# Altium schematic sheet DDC.SchDoc: Apalis Evaluation Board 1.1
size A3; Organization: Toradex AG; Address1: Altsagenstrasse 5; Address2: Horw; Address3: 6048; Address4: Switzerland; DocumentNumber: 19; Revision: V1.1; SheetNumber: 19; SheetTotal: 32; PageSetup: Record=PageOptions|CenterHorizontal=True|CenterVertical=True|PrintScale=0.71|XCorrection=1.00|YCorrection=1.00|PrintKind=0|BorderSize=5000000|LeftOffset=0|BottomOffset=0|Orientation=2|PaperLength=1000|PaperWidth=1000|Scale=100|PaperSource=7|PrintQuality=-4|MediaType=1|DitherType=10|PaperKind=A4|PrintScaleMode=1
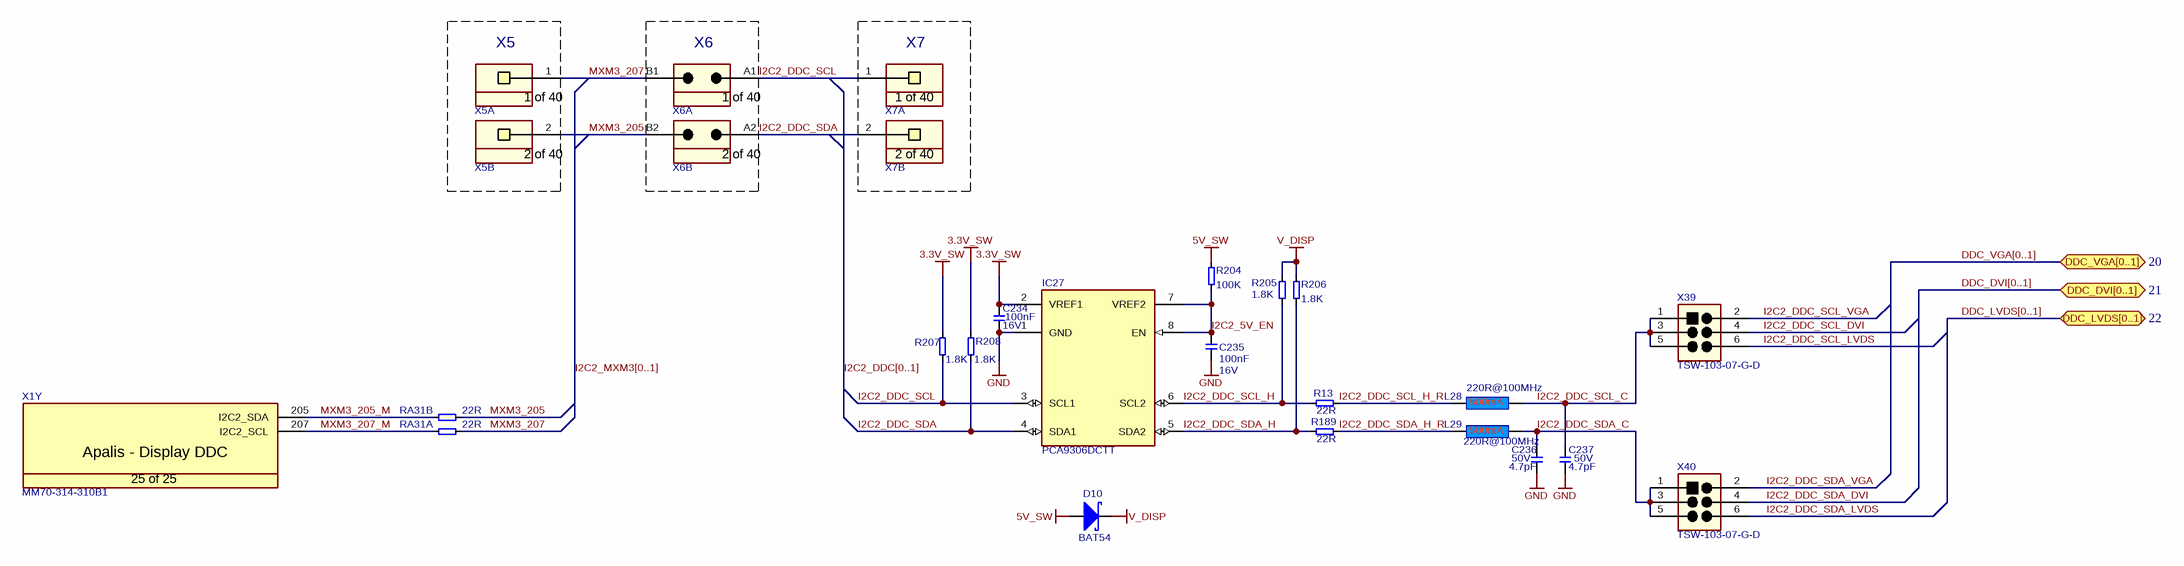
[diagram p0: DDC.SchDoc]

## Parts
C234  Rating: 16V  [T_CAPC0603X33N]  (hidden comment: 100nF)
C235  Rating: 16V  [T_CAPC0603X33N]  (hidden comment: 100nF)
C236  Rating: 50V  [T_CAPC0603X33N]  (hidden comment: 4.7pF)
C237  Rating: 50V  [T_CAPC0603X33N]  (hidden comment: 4.7pF)
D10  BAT54  [SOT95P230X110-3N]
IC27  PCA9306DCTT  [T_TI_PCA9306DCTT]
L28  220R@100MHz  [INDC1608X95N]
L29  220R@100MHz  [INDC1608X95N]
R13  22R  [T_RESC0603X30N]
R189  22R  [T_RESC0603X30N]
R204  100K  [T_RESC0603X30N]
R205  1.8K  [T_RESC0603X30N]
R206  1.8K  [T_RESC0603X30N]
R207  1.8K  [T_RESC0603X30N]
R208  1.8K  [T_RESC0603X30N]
RA31  22R  [T_Resistor_Array_X4]  (parts A,B of 4)
X1  Manufacturer Part No.: MM70-314-310B1  [T_JAE_MM70-314-310B1]  (hidden comment: CON-JAE-MM70-314-310B1-314-0.5mm)  (part Y of 25)
X5  SSW-110-01-G-S  [T_Samtec_SSW-110-01-G-S]  (value not drawn)  (parts A,B of 40)
X6  TSW-110-07-G-D  [T_Samtec_TSW-110-07-G-D]  (value not drawn)  (parts A,B of 40)
X7  SSW-110-01-G-S  [T_Samtec_SSW-110-01-G-S]  (value not drawn)  (parts A,B of 40)
X39  TSW-103-07-G-D  [T_Samtec_TSW-103-07-G-D]
X40  TSW-103-07-G-D  [T_Samtec_TSW-103-07-G-D]

## Blocks framed on the sheet
X5: X5
X6: X6
X7: X7

## Ports
DDC_DVI[0..1] (bidir, see 21), DDC_LVDS[0..1] (bidir, see 22), DDC_VGA[0..1] (bidir, see 20)

## Nets
3.3V_SW: C234.2 IC27.2(VREF1) R207.2 R208.2
5V_SW: D10.1 R204.2
GND: C234.1 C235.1 C236.2 C237.2 IC27.1(GND)
V_DISP: D10.3 R205.1 R206.1
I2C2_5V_EN: C235.2 IC27.7(VREF2) IC27.8(EN) R204.1
I2C2_DDC_SCL: IC27.3(SCL1) R207.1 X6.A1 X7.1
I2C2_DDC_SCL_C: C237.1 L28.2 X39.1 X39.3 X39.5
I2C2_DDC_SCL_DVI: X39.4
I2C2_DDC_SCL_H: IC27.6(SCL2) R13.1 R205.2
I2C2_DDC_SCL_H_R: L28.1 R13.2
I2C2_DDC_SCL_LVDS: X39.6
I2C2_DDC_SCL_VGA: X39.2
I2C2_DDC_SDA: IC27.4(SDA1) R208.1 X6.A2 X7.2
I2C2_DDC_SDA_C: C236.1 L29.2 X40.1 X40.3 X40.5
I2C2_DDC_SDA_DVI: X40.4
I2C2_DDC_SDA_H: IC27.5(SDA2) R189.1 R206.2
I2C2_DDC_SDA_H_R: L29.1 R189.2
I2C2_DDC_SDA_LVDS: X40.6
I2C2_DDC_SDA_VGA: X40.2
MXM3_205: RA31.6 X5.2 X6.B2
MXM3_205_M: RA31.2 X1.205(I2C2_SDA)
MXM3_207: RA31.5 X5.1 X6.B1
MXM3_207_M: RA31.1 X1.207(I2C2_SCL)

## Buses and harness runs
bus DDC_DVI[0..1] = port DDC_DVI[0..1]
bus DDC_LVDS[0..1] = port DDC_LVDS[0..1]
bus DDC_VGA[0..1] = port DDC_VGA[0..1]
bus I2C2_DDC[0..1]
bus I2C2_MXM3[0..1]

## Notes on the sheet
- Title
- Size:
- Date:
- A3
- Number:
- Time:
- Revision:
- Sheet
- of
- File:
- (in symbol CON-JAE-MM70-314-310B1-314-0.5mm, part Y) Apalis - Display DDC; 25 of 25
- (in symbol CON-Samtec-SSW-110-01-G-S, part A) 1 of 40
- (in symbol CON-Samtec-SSW-110-01-G-S, part B) 2 of 40
- (in symbol CON-Samtec-TSW-110-07-G-D, part A) 1 of 40
- (in symbol CON-Samtec-TSW-110-07-G-D, part B) 2 of 40

## Library data of the parts
C234 C235 = C-X7R-100nF-16V-10%-0603: Capacitor Ceramic X7R 100nF 16V 10% 0603; Tolerance: 10%; Type: X7R; Value: 100nF
C236 C237 = C-NP0-4.7pF-25V-10%-0603: Capacitor Ceramic NP0  4.7pF 25V 10% 0603; Tolerance: 10%; Type: NP0; Value: 4.7pF
D10 = D-Philips-BAT54-Schottky: BAT54 Schottky Diode; Manufacturer Name: Philips; Manufacturer Part No.: BAT54
IC27 = IC-TI-PCA9306DCTT: Dual Bidirectional I2C and SMBus Voltage-Level Translator; Manufacturer Name: Texas Instruments; Manufacturer Part No.: PCA9306DCTT
L28 L29 = L-220R@100MHz-500mA-25%-0603: 220R@100MHz 500mA EMI FILTER; Tolerance: 25%; Rating: 500mA; Value: 220R@100MHz
R13 R189 = R-22R-63mW-5%-0603: Resistor 22 ohm 63mW 5% 0603; Rating: 63mW; Tolerance: 5%; Value: 22R
R204 = R-100KR-63mW-5%-0603: Resistor 100 Kohm 63mW 5% 0603; Value: 100KR; Rating: 63mW; Tolerance: 5%
R205-R208 = R-1.8KR-63mW-5%-0603: Resistor 1.8 Kohm 63mW 5% 0603; Value: 1.8KR; Rating: 63mW; Tolerance: 5%
RA31 = RA-22R-63mW-5%-1206-div: Resistor Array 22 R 63mW 5% 1206; Tolerance: 5%; Power Dissipation: 63mW; Value: 22R
X1 = CON-JAE-MM70-314-310B1-314-0.5mm: MXM3 Connector; Manufacturer Name: JAE; No. of ways: 314
X5 X7 = CON-Samtec-SSW-110-01-G-S: Receptacle Female Socket 1x40 pin 2.54mm pitch; Manufacturer Name: Samtec; Pitch: 2.54mm; No. of ways: 1x40; Manufacturer Part No.: SSW-110-01-G-S
X6 = CON-Samtec-TSW-110-07-G-D: Header 2x40 pin 2.54mm pitch; Manufacturer Name: Samtec; Pitch: 2.54mm; No. of ways: 2x40; Manufacturer Part No.: TSW-110-07-G-D
X39 X40 = CON-Samtec-TSW-103-07-G-D-SIM: Header Male, 2x3 Pins, 2.54mm pitch; Manufacturer Name: Samtec; No. of. ways: 2x3; Pitch: 2.54mm; Manufacturer Part No.: TSW-103-07-G-D